# EAGLE design RAMPS_1-3i (EAGLE 7.3.0)
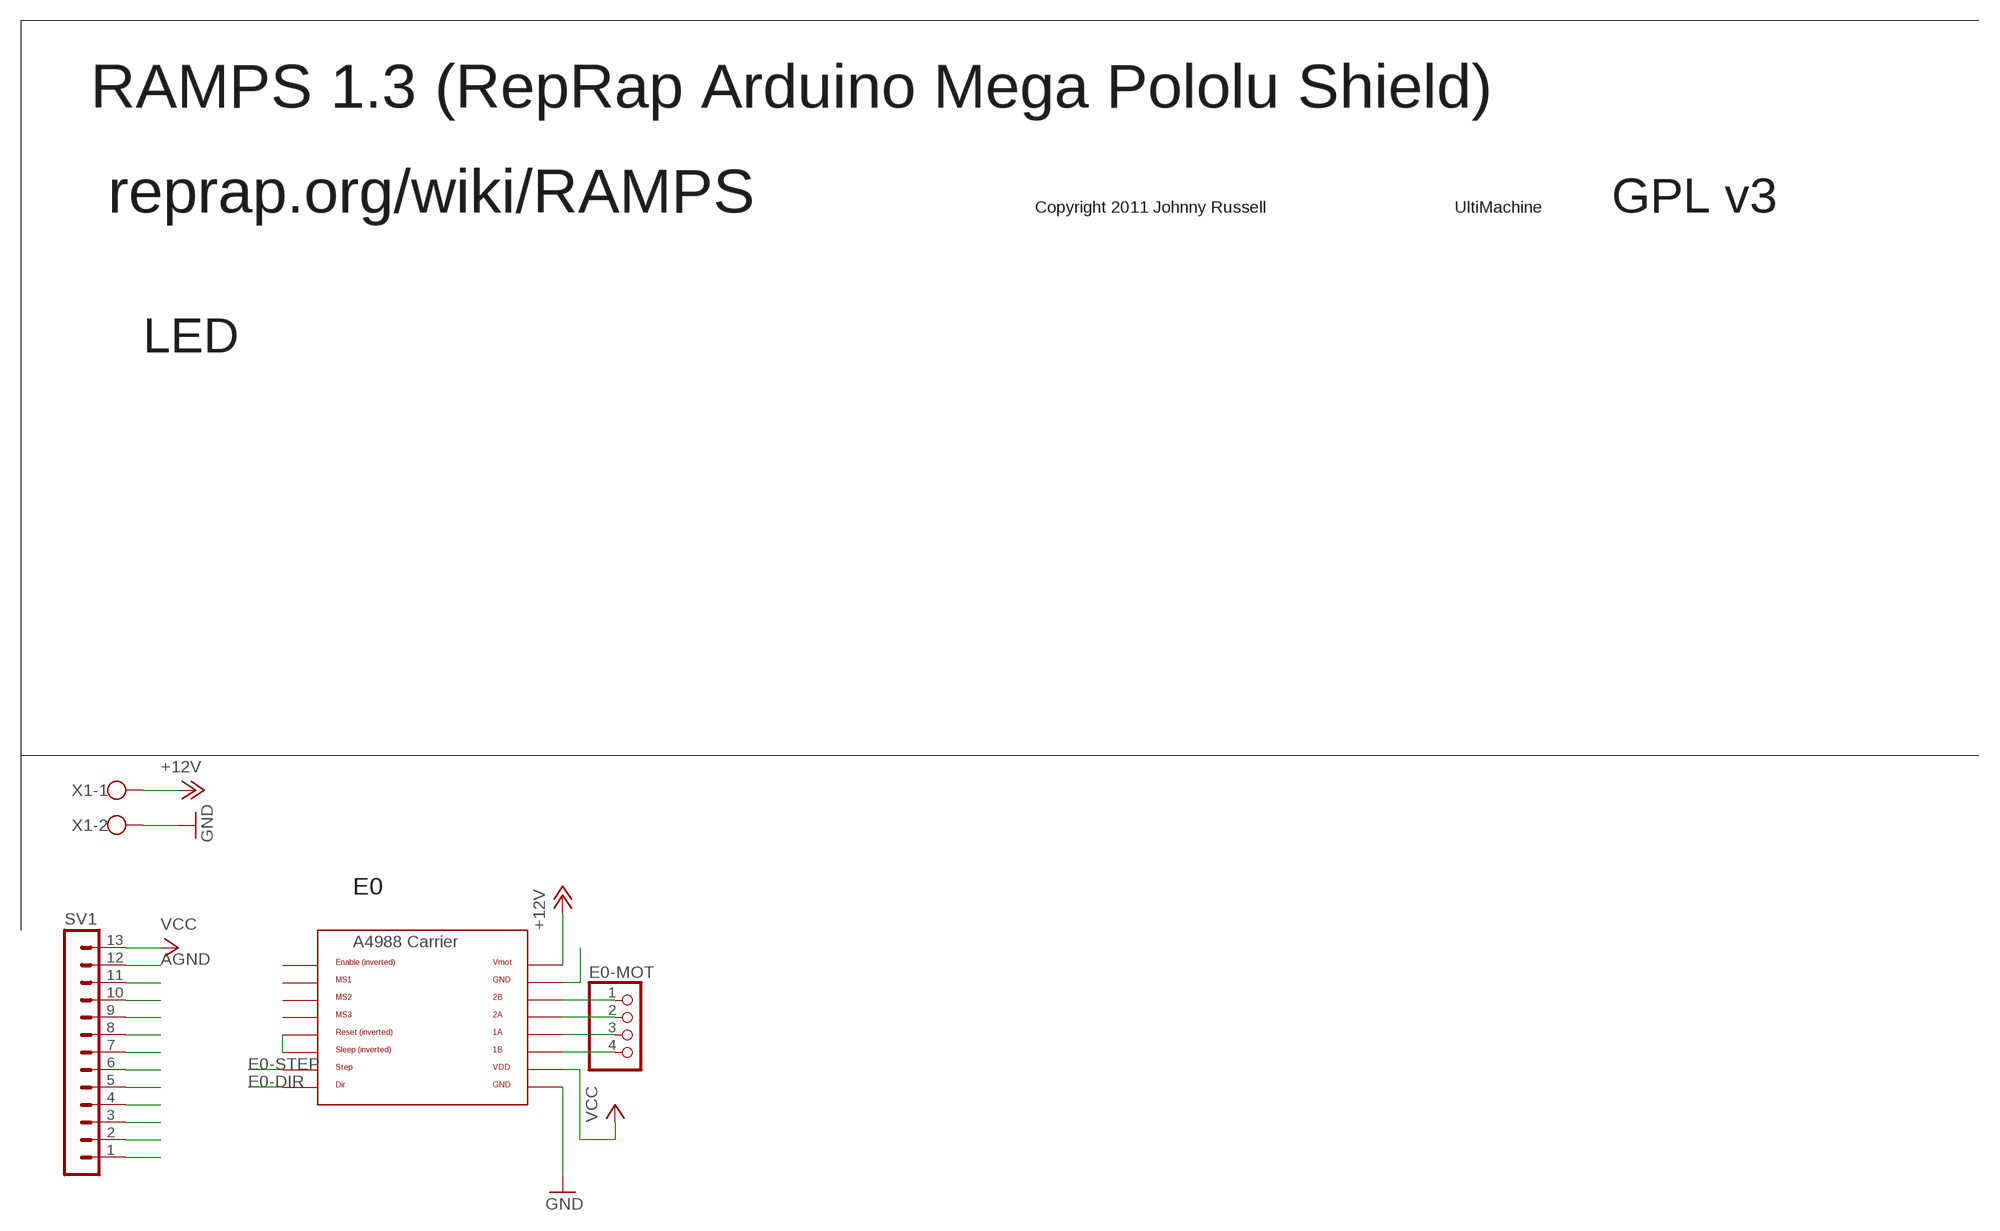
[diagram p0: schematic, sheet 1]

## Parts
E0-MOT  PINHD-1X4  [1X04]
SV1  MA13-1  [MA13-1]
U$4  A4988BREAKOUT  [A4988BREAKOUT]
X1  W237-102  [W237-102]

## Nets
+12V: U$4.VMOT X1.1
AGND: SV1.12 U$4.GND
E0-DIR: SV1.1 U$4.DIR
E0-STEP: SV1.2 U$4.STEP
GND: U$4.GND@0(GND) X1.2
N$3: E0-MOT.1 U$4.2B
N$4: E0-MOT.2 U$4.2A
N$5: SV1.3
N$6: SV1.4
N$7: SV1.5
N$8: U$4.RST U$4.SLP(SLEEP)
N$9: SV1.6
N$10: E0-MOT.3 U$4.1A
N$11: E0-MOT.4 U$4.1B
N$12: SV1.7
N$13: SV1.8
N$14: SV1.9
N$15: SV1.10
N$16: SV1.11
VCC: SV1.13 U$4.VDD
Unconnected: U$4.EN U$4.MS1 U$4.MS2 U$4.MS3

## Notes on the sheet
- RAMPS 1.3 (RepRap Arduino Mega Pololu Shield)
- reprap.org/wiki/RAMPS | Copyright 2011 Johnny Russell | UltiMachine | GPL v3
- LED
- E0

## Library data of the parts
E0-MOT = RepRapjr:PINHD-1X4: PIN HEADER
SV1 = con-lstb:MA13-1: PIN HEADER; OC_FARNELL: unknown; OC_NEWARK: unknown
U$4 = RepRapjr:A4988BREAKOUT
X1 = con-wago-500:W237-102: WAGO SCREW CLAMP; MPN: 237-102; OC_FARNELL: unknown; OC_NEWARK: 70K9898

## Board
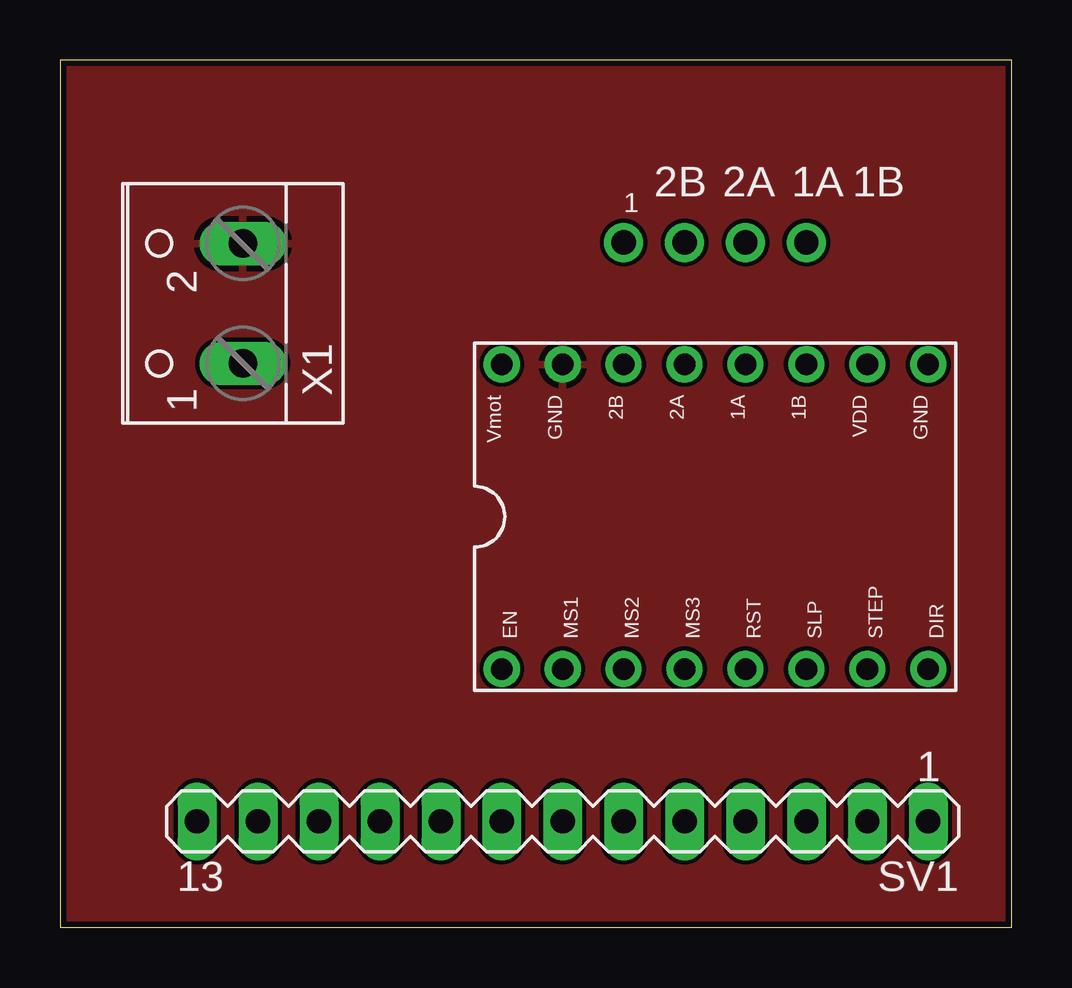
[diagram p1: board, top side]
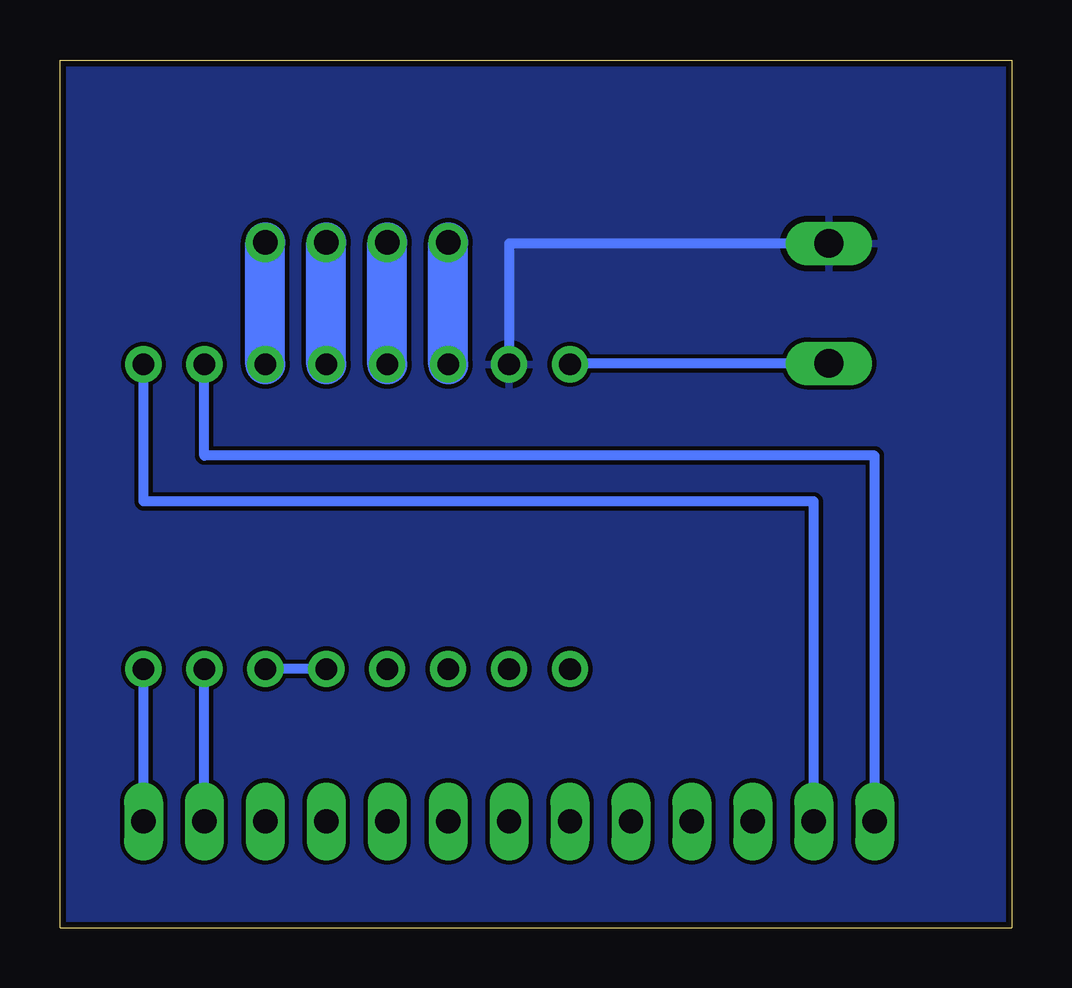
[diagram p2: board, bottom side, seen from below]

Size 39.67 x 36.18 mm. Coordinates in mm from the lower left corner, seen from the top.
Outline: 39.67,0 39.67,36.18 0,36.18 0,0 39.67,0
Copper layers (1*16): Top 0.035mm / dielectric 1.5mm / Bottom 0.035mm
Design rules "ramps1-3 *": minimum track width 7mil, minimum drill 15mil, track to track 7mil, track to pad 7mil, pad to pad 7mil, via to via 7mil, smd to smd 7mil, copper to edge 10mil, drill to drill 8mil, minimum pad ring 12mil, minimum via ring 12mil, stop-mask expansion 4mil, vias tented up to drill 25mil, thermal gap 10mil

### Footprints (pad centres in the part's own frame; a part is rotated, then mirrored left to right if it is on the bottom)
1X04 = drill 1.016: 1 -2.54,0; 2 0,0; 3 2.54,0; 4 5.08,0
MA13-1 = drill 1.016 long: 1 -15.24,0; 2 -12.7,0; 3 -10.16,0; 4 -7.62,0; 5 -5.08,0; 6 -2.54,0; 7 0,0; 8 2.54,0; 9 5.08,0; 10 7.62,0; 11 10.16,0; 12 12.7,0; 13 15.24,0
A4988BREAKOUT = drill 0.9: 1A 8.89,1.27; 1B 11.43,1.27; 2A 6.35,1.27; 2B 3.81,1.27; DIR 16.51,-11.43; EN -1.27,-11.43; GND 16.51,1.27; GND@0 1.27,1.27; MS1 1.27,-11.43; MS2 3.81,-11.43; MS3 6.35,-11.43; RST 8.89,-11.43; SLP 11.43,-11.43; STEP 13.97,-11.43; VDD 13.97,1.27; VMOT -1.27,1.27
W237-102 = drill 1.194 long: 1 -2.5,-1.27; 2 2.5,-1.27

### Placement (x,y rotation side)
E0-MOT  26.03,28.58 0 top
SV1  20.96,4.45 180 top
U$4  19.68,22.23 0 top
X1  6.35,26.04 90 top

### Tracks (layer width: path | path; a pad name or v marks a point on that pad's centre or on a via)
+12V
  Bottom 0.406: X1.1 18.41,23.54 U$4.VMOT
AGND
  Bottom 0.406: SV1.12 8.25,17.78 36.2,17.78 U$4.GND
E0-DIR
  Bottom 0.406: SV1.1 U$4.DIR
E0-STEP
  Bottom 0.406: SV1.2 U$4.STEP
GND
  Bottom 0.406: X1.2 20.96,28.54 U$4.GND@0
  pour Top: -2.54,36.2 40.64,36.2 40.64,-3.17 -2.54,-3.17
  pour Bottom: -2.54,36.2 40.64,36.2 40.64,-3.17 -2.54,-3.17
N$3
  Bottom 1.676: U$4.2B E0-MOT.1
N$4
  Bottom 1.676: U$4.2A E0-MOT.2
N$8
  Bottom 0.406: U$4.RST U$4.SLP
N$10
  Bottom 1.676: U$4.1A E0-MOT.3
N$11
  Bottom 1.676: U$4.1B E0-MOT.4
VCC
  Bottom 0.406: SV1.13 5.71,19.69 33.66,19.69 U$4.VDD

### Text on the board
tNames: 2B | 2A | 1A | 1B
_tsilk: 1